# Altium schematic sheet CAN.SchDoc
size 209 x 297 mm; SheetNumber: 6; SheetTotal: 6; Разработчик: Волков; Проверяющий: Андрейчук; Технический_контроль: Ашуркевич; Нормативный_контроль: Василевская; Утвердил: Чвала; Номер_листа: 1; Количество_листов: 4; Организация: МРК; Номер_документа: ТЗСЦ.421457.001Э3; Название_документа: Устройство управления сервоприводами на основе микроконтроллера STM32
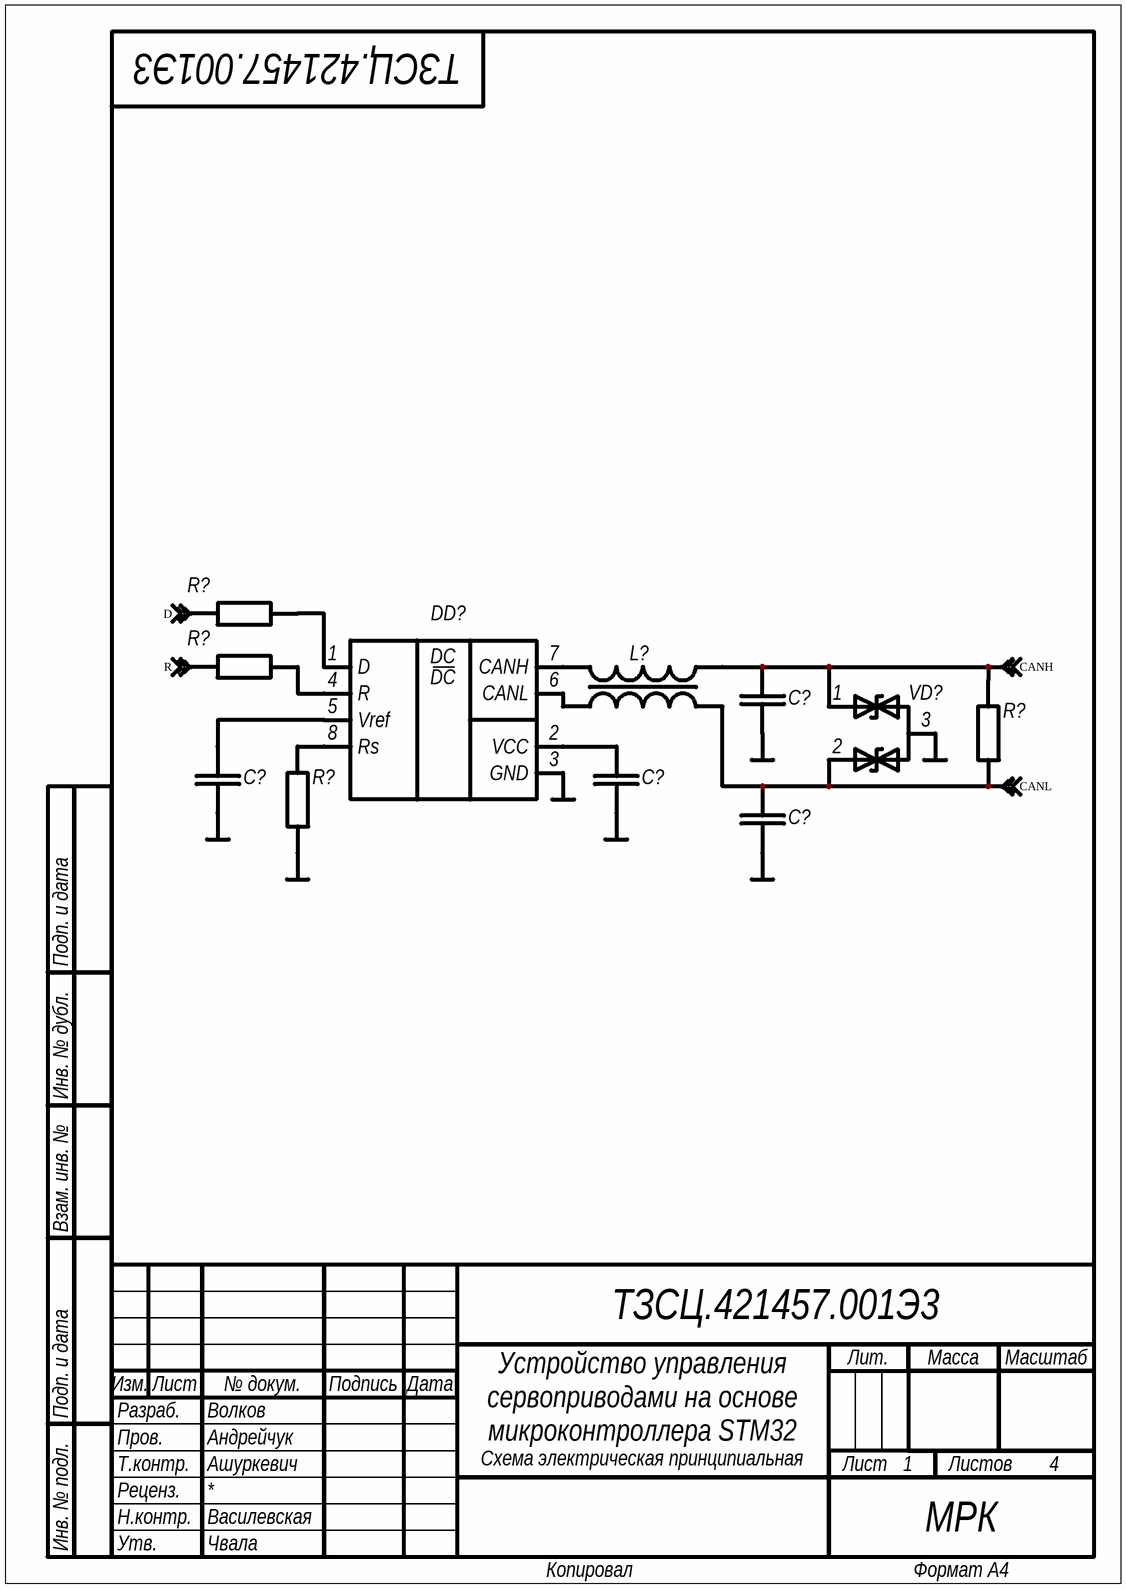
[diagram p0: CAN.SchDoc]

## Parts
(Parts that share a designator on the sheet are numbered #1, #2 ... from top to bottom, then left to right.)
C?#1  Capacitor_Fixed  (value not drawn)
C?#2  Capacitor_Fixed  (value not drawn)
C?#3  Capacitor_Fixed  (value not drawn)
C?#4  Capacitor_Fixed  (value not drawn)
DD?  VP230  (value not drawn)
L?  Inductor_Cored_Double  (value not drawn)
R?#1  Resistor_Fixed  (value not drawn)
R?#2  Resistor_Fixed  (value not drawn)
R?#3  Resistor_Fixed  (value not drawn)
R?#4  Resistor_Fixed  (value not drawn)
VD?  SM24CANB-02HTG  (value not drawn)

## Nets
GND: C?#1.2 C?#2.1 C?#3.1 C?#4.1 DD?.3(GND) R?#4.1 VD?.3(COM)
CANH: C?#1.1 L?.4 R?#3.2 VD?.1(CANH) ; off-sheet CANH
CANL: C?#4.2 L?.3 R?#3.1 VD?.2(CANL) ; off-sheet CANL
D: R?#1.1 ; off-sheet D
R: R?#2.1 ; off-sheet R
NetC?#2_2: C?#2.2 DD?.5(Vref)
NetC?#3_2: C?#3.2 DD?.2(VCC)
NetDD?_1: DD?.1(D) R?#1.2
NetDD?_4: DD?.4(R) R?#2.2
NetDD?_6: DD?.6(CANL) L?.2
NetDD?_7: DD?.7(CANH) L?.1
NetDD?_8: DD?.8(Rs) R?#4.2

## Notes on the sheet
- Подп. и дата
- Инв. № дубл.
- Взам. инв. №
- Разраб.
- Изм.
- Лист
- № докум.
- Подпись
- Дата
- Лит.
- Масса
- Масштаб
- Пров.
- Т.контр.
- Схема электрическая принципиальная
- Листов
- Реценз.
- Н.контр.
- Утв.
- Инв. № подл.
- Копировал
- Формат А4
- (in symbol Microcircuit_Digital_Transceiver_UART_CAN) DC

## Library data of the parts
C?#1-C?#4 = Capacitor_Fixed: 2 pin
DD? = Microcircuit_Digital_Transceiver_UART_CAN: 8 pin 3,3V; ComponentLink1Description: chipdip; ComponentLink1URL: https://www.chipdip.ru/product/sn65hvd230d; ComponentLink2Description: datasheet; ComponentLink2URL: https://static.chipdip.ru/lib/204/DOC000204848.pdf
L? = Inductor_Cored_Double: 4 pin
R?#1-R?#4 = Resistor_Fixed: 2 pin
VD? = Diode_CAN_Array_Supressors_SM24CANB-02HTG: 3 pin; ComponentLink1Description: chipdip; ComponentLink1URL: https://www.chipdip.ru/product0/8002766404; ComponentLink2Description: datasheet; ComponentLink2URL: https://static.chipdip.ru/lib/251/DOC011251842.pdf